# EAGLE schematic watch (EAGLE 5.11)
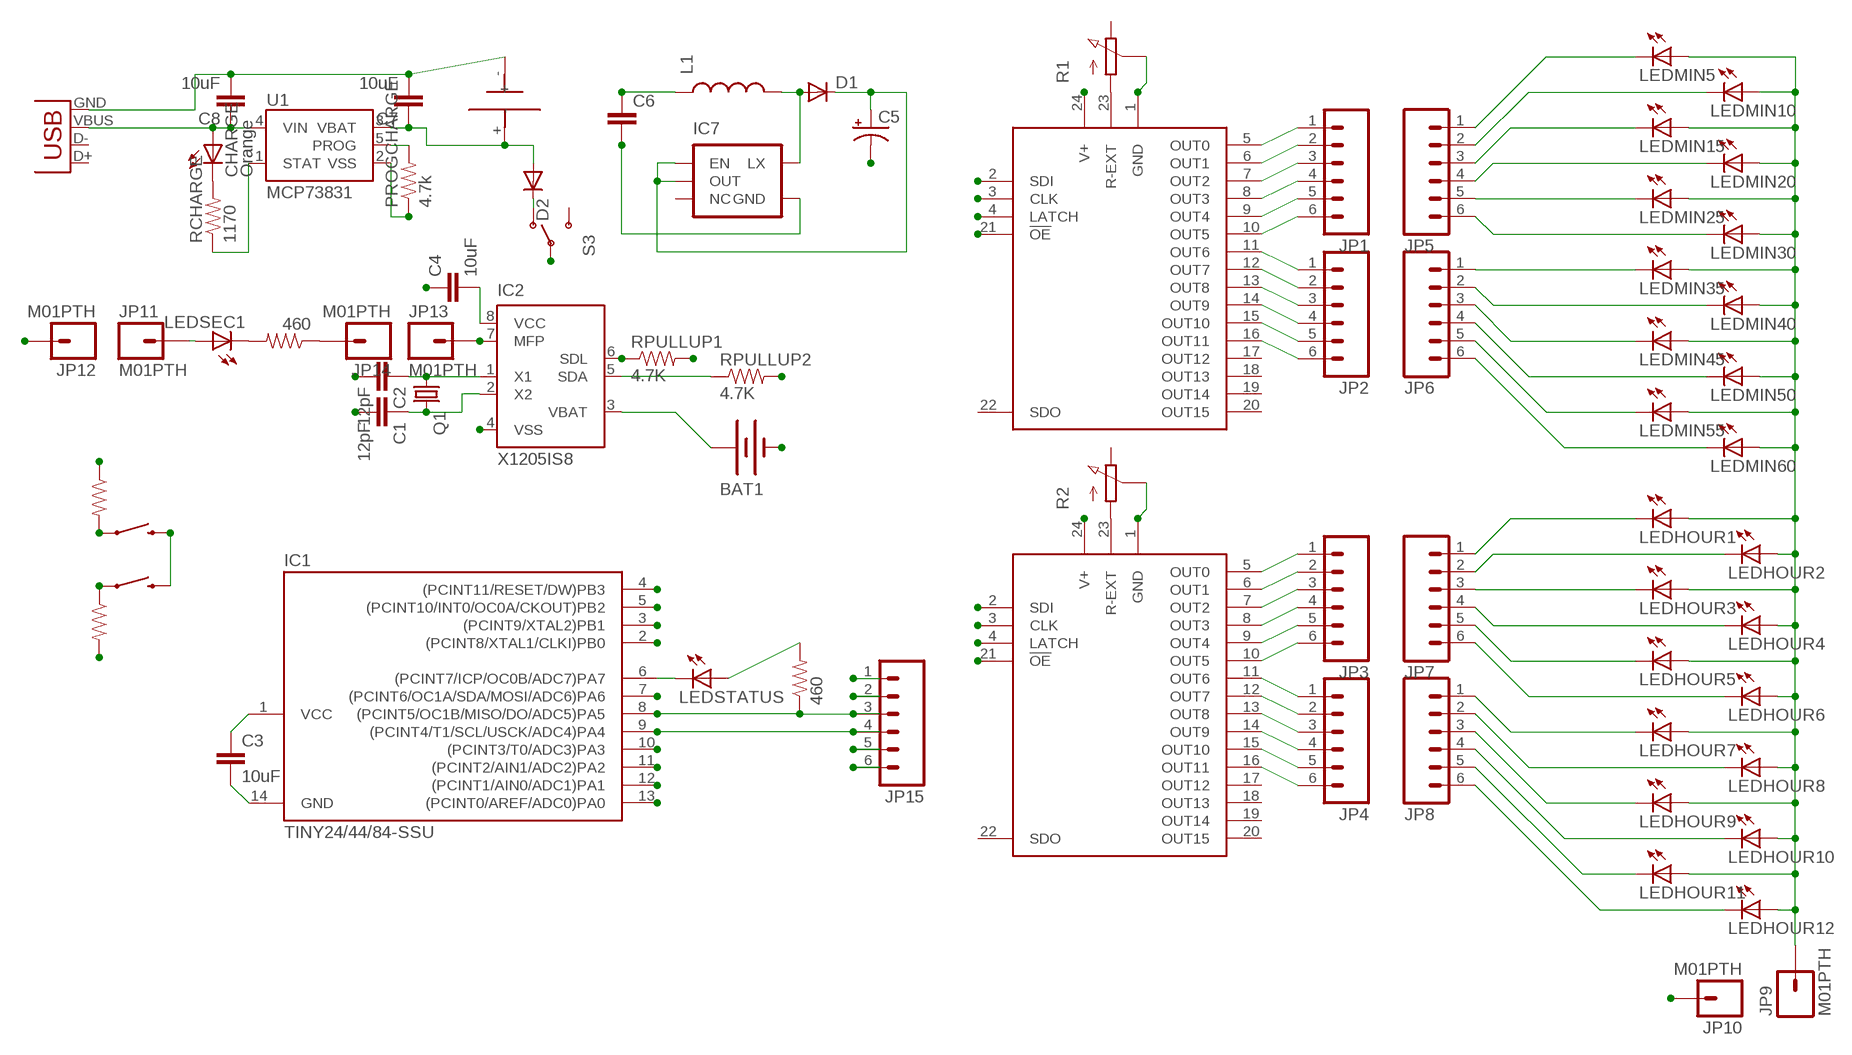
[diagram p0: schematic, sheet 1]

## Parts
BAT1  BATTERY12MM  [BATTCON_12MM]
C1  12pF  CAP0805  [0805]
C2  12pF  CAP0805  [0805]
C3  10uF  CAP0805  [0805]
C4  10uF  CAP0805  [0805]
C5  CAP_POL3528-KIT  [EIA3528-KIT]
C6  CAP0805  [0805]
C7  10uF  CAP0805  [0805]
C8  10uF  CAP0805  [0805]
CHARGE  Orange  LEDCHIPLED_0805  [CHIPLED_0805]
D1  DIODE-SOD80C  [SOD80C]
D2  DIODE-SOD80C  [SOD80C]
G1  RCR123A  [CR2/3]
IC1  TINY24/44/84-SSU  [SOIC14]
IC2  X1205IS8  [SO-08]
IC3  TLC5925I  [SO24L]
IC4  TLC5925I  [SO24L]
IC7  V_REG_NCP1400SOT23-5  [SOT23-5]
JP1  M06SIP  [1X06]
JP2  M06SIP  [1X06]
JP3  M06SIP  [1X06]
JP4  M06SIP  [1X06]
JP5  M06SIP  [1X06]
JP6  M06SIP  [1X06]
JP7  M06SIP  [1X06]
JP8  M06SIP  [1X06]
JP9  M01PTH  [1X01]
JP10  M01PTH  [1X01]
JP11  M01PTH  [1X01]
JP12  M01PTH  [1X01]
JP13  M01PTH  [1X01]
JP14  M01PTH  [1X01]
JP15  M06SMD  [1X06-SMD]
L1  INDUCTOR-B82462G  [B82462G]
LEDHOUR1  LEDCHIPLED_0805  [CHIPLED_0805]
LEDHOUR2  LEDCHIPLED_0805  [CHIPLED_0805]
LEDHOUR3  LEDCHIPLED_0805  [CHIPLED_0805]
LEDHOUR4  LEDCHIPLED_0805  [CHIPLED_0805]
LEDHOUR5  LEDCHIPLED_0805  [CHIPLED_0805]
LEDHOUR6  LEDCHIPLED_0805  [CHIPLED_0805]
LEDHOUR7  LEDCHIPLED_0805  [CHIPLED_0805]
LEDHOUR8  LEDCHIPLED_0805  [CHIPLED_0805]
LEDHOUR9  LEDCHIPLED_0805  [CHIPLED_0805]
LEDHOUR10  LEDCHIPLED_0805  [CHIPLED_0805]
LEDHOUR11  LEDCHIPLED_0805  [CHIPLED_0805]
LEDHOUR12  LEDCHIPLED_0805  [CHIPLED_0805]
LEDMIN5  LEDCHIPLED_0805  [CHIPLED_0805]
LEDMIN10  LEDCHIPLED_0805  [CHIPLED_0805]
LEDMIN15  LEDCHIPLED_0805  [CHIPLED_0805]
LEDMIN20  LEDCHIPLED_0805  [CHIPLED_0805]
LEDMIN25  LEDCHIPLED_0805  [CHIPLED_0805]
LEDMIN30  LEDCHIPLED_0805  [CHIPLED_0805]
LEDMIN35  LEDCHIPLED_0805  [CHIPLED_0805]
LEDMIN40  LEDCHIPLED_0805  [CHIPLED_0805]
LEDMIN45  LEDCHIPLED_0805  [CHIPLED_0805]
LEDMIN50  LEDCHIPLED_0805  [CHIPLED_0805]
LEDMIN55  LEDCHIPLED_0805  [CHIPLED_0805]
LEDMIN60  LEDCHIPLED_0805  [CHIPLED_0805]
LEDSEC1  LEDCHIPLED_0805  [CHIPLED_0805]
LEDSTATUS  LEDCHIPLED_0805  [CHIPLED_0805]
PROGCHARGE  4.7k  RESISTOR0805-RES  [0805]
Q1  MC-306  [MC-306]
R1  PC25PVZ2A  [PC25]
R2  PC25PVZ2A  [PC25]
RCHARGE  1170  RESISTOR0805-RES  [0805]
RPULLUP1  4.7K  RESISTOR0805-RES  [0805]
RPULLUP2  4.7K  RESISTOR0805-RES  [0805]
RPULLUP3  4.7K  RESISTOR0805-RES  [0805]
RPULLUP4  4.7K  RESISTOR0805-RES  [0805]
RSEC  460  RESISTOR0805-RES  [0805]
RSTATUS  460  RESISTOR0805-RES  [0805]
S1  SWITCH-MOMENTARY-2-SMD-1101NE  [TACTILE-SWITCH-1101NE]
S2  SWITCH-MOMENTARY-2-SMD-1101NE  [TACTILE-SWITCH-1101NE]
S3  SWITCH-SPST-SMD-A  [SWITCH-SPST-SMD-A]
U1  MCP73831  [SOT23-5]
X1  USB-MICROB  [USB-MICROB]

## Nets
1HZ: IC1.5((PCINT10/INT0/OC0A/CKOUT)PB2) IC2.7(MFP) JP13.1
BATBACKUP: BAT1.PWR@1(+) IC2.3(VBAT)
FF: IC1.3((PCINT9/XTAL2)PB1) RPULLUP4.1 S2.P$1
GND: BAT1.GND(-) C1.2 C2.2 C3.2 C4.1 C5.C(-) C6.2 C7.2 C8.2 G1.- IC1.14(GND) IC2.4(VSS) IC3.1(GND) IC4.1(GND) IC7.4(GND) JP15.1 PROGCHARGE.1 R1.2(WIPER) R2.2(WIPER) S1.P$2 S2.P$2 U1.2(VSS) X1.GND
HOURCLOCK: IC1.11((PCINT2/AIN1/ADC2)PA2) IC4.3(CLK)
MINUTECLOCK: IC1.13((PCINT0/AREF/ADC0)PA0) IC3.3(CLK)
MISO: IC1.8((PCINT5/OC1B/MISO/DO/ADC5)PA5) JP15.3 RSTATUS.1
N$1: D1.A IC7.5(LX) L1.P$2
N$2: IC3.5(OUT0) JP1.1
N$3: IC3.6(OUT1) JP1.2
N$4: C2.1 IC2.1(X1) Q1.1
N$5: IC3.7(OUT2) JP1.3
N$6: IC3.8(OUT3) JP1.4
N$7: IC3.9(OUT4) JP1.5
N$8: LEDSEC1.C RSEC.2
N$9: CHARGE.C RCHARGE.2
N$10: RCHARGE.1 U1.1(STAT)
N$11: PROGCHARGE.2 U1.5(PROG)
N$12: IC3.10(OUT5) JP1.6
N$13: IC3.11(OUT6) JP2.1
N$14: IC3.12(OUT7) JP2.2
N$15: IC3.13(OUT8) JP2.3
N$16: JP6.4 LEDMIN50.C
N$17: IC3.14(OUT9) JP2.4
N$18: IC3.15(OUT10) JP2.5
N$19: IC3.16(OUT11) JP2.6
N$20: IC4.5(OUT0) JP3.1
N$21: IC4.6(OUT1) JP3.2
N$22: IC4.7(OUT2) JP3.3
N$23: IC4.8(OUT3) JP3.4
N$24: IC4.9(OUT4) JP3.5
N$25: IC4.10(OUT5) JP3.6
N$26: IC4.11(OUT6) JP4.1
N$27: IC4.12(OUT7) JP4.2
N$28: IC4.13(OUT8) JP4.3
N$29: IC4.14(OUT9) JP4.4
N$30: IC4.15(OUT10) JP4.5
N$31: IC4.16(OUT11) JP4.6
N$32: JP5.1 LEDMIN5.C
N$33: JP5.2 LEDMIN10.C
N$34: JP5.3 LEDMIN15.C
N$35: JP5.4 LEDMIN20.C
N$36: JP5.5 LEDMIN25.C
N$37: JP5.6 LEDMIN30.C
N$38: JP6.1 LEDMIN35.C
N$39: JP6.2 LEDMIN40.C
N$40: JP6.3 LEDMIN45.C
N$41: JP6.5 LEDMIN55.C
N$42: JP6.6 LEDMIN60.C
N$43: JP7.1 LEDHOUR1.C
N$44: JP7.2 LEDHOUR2.C
N$45: JP7.3 LEDHOUR3.C
N$46: JP7.4 LEDHOUR4.C
N$47: JP7.5 LEDHOUR5.C
N$48: JP7.6 LEDHOUR6.C
N$49: JP8.1 LEDHOUR7.C
N$50: JP8.2 LEDHOUR8.C
N$51: JP8.3 LEDHOUR9.C
N$52: JP8.4 LEDHOUR10.C
N$53: JP8.5 LEDHOUR11.C
N$54: JP8.6 LEDHOUR12.C
N$55: JP11.1 LEDSEC1.A
N$56: IC3.23(R-EXT) R1.1(VCC)
N$57: C1.1 IC2.2(X2) Q1.4
N$58: IC1.6((PCINT7/ICP/OC0B/ADC7)PA7) LEDSTATUS.C
N$59: LEDSTATUS.A RSTATUS.2
N$60: D2.C S3.1(O)
N$61: JP14.1 RSEC.1
N$62: IC4.23(R-EXT) R2.1(VCC)
OE: IC1.12((PCINT1/AIN0/ADC1)PA1) IC3.21(!OE) IC4.21(!OE)
RESET: IC1.4((PCINT11/RESET/DW)PB3) JP15.5
RW: IC1.2((PCINT8/XTAL1/CLKI)PB0) RPULLUP3.2 S1.P$1
SCL: IC1.9((PCINT4/T1/SCL/USCK/ADC4)PA4) IC2.6(SDL) JP15.4 RPULLUP1.1
SDA: IC1.7((PCINT6/OC1A/SDA/MOSI/ADC6)PA6) IC2.5(SDA) JP15.6 RPULLUP2.1
SERIALOUT: IC1.10((PCINT3/T0/ADC3)PA3) IC3.2(SDI) IC4.2(SDI)
VCC: C5.A(+) D1.C IC7.1(EN) IC7.2(OUT) JP10.1
VCCTOP: JP9.1 LEDHOUR1.A LEDHOUR2.A LEDHOUR3.A LEDHOUR4.A LEDHOUR5.A LEDHOUR6.A LEDHOUR7.A LEDHOUR8.A LEDHOUR9.A LEDHOUR10.A LEDHOUR11.A LEDHOUR12.A LEDMIN5.A LEDMIN10.A LEDMIN15.A LEDMIN20.A LEDMIN25.A LEDMIN30.A LEDMIN35.A LEDMIN40.A LEDMIN45.A LEDMIN50.A LEDMIN55.A LEDMIN60.A
VRAW: C7.1 D2.A G1.+ U1.3(VBAT)
VRAWSWITCHED: C3.1 C4.2 C6.1 IC1.1(VCC) IC2.8(VCC) IC3.4(LATCH) IC3.24(V+) IC4.4(LATCH) IC4.24(V+) JP12.1 JP15.2 L1.P$1 RPULLUP1.2 RPULLUP2.2 RPULLUP3.1 RPULLUP4.2 S3.2(P)
VUSB: C8.1 CHARGE.A U1.4(VIN) X1.VBUS
Unconnected: IC3.17(OUT12) IC3.18(OUT13) IC3.19(OUT14) IC3.20(OUT15) IC3.22(SDO) IC4.17(OUT12) IC4.18(OUT13) IC4.19(OUT14) IC4.20(OUT15) IC4.22(SDO) IC7.3(NC) R1.3(GND) R2.3(GND) S3.3(S) X1.D+ X1.D-

## Library data of the parts
BAT1 = SparkFun:BATTERY: Battery Holders Various common sizes : AA, AAA, 20mm coin cell and 12mm coin cell.
C1-C4 C6-C8 = SparkFun:CAP: Capacitor Standard 0603 ceramic capacitor, and 0.1" leaded capacitor.
C5 = SparkFun:CAP_POL: Capacitor Polarized These are standard SMD and PTH capacitors. Normally 10uF, 47uF, and 100uF in electrolytic and tantalum varieties. Always verify the external diameter of the through hole cap, it varies with capacity, voltage, and manufacturer. The EIA devices should be standard.
CHARGE LEDHOUR1-LEDHOUR12 LEDMIN5 LEDMIN10 LEDMIN15 LEDMIN20 LEDMIN25 LEDMIN30 LEDMIN35 LEDMIN40 LEDMIN45 LEDMIN50 LEDMIN55 LEDMIN60 LEDSEC1 LEDSTATUS = led:LED: LED OSRAM: - CHIPLED LG R971, LG N971, LY N971, LG Q971, LY Q971, LO R971, LY R971 LH N974, LH R974 LS Q976, LO Q976, LY Q976 LO Q996 - Hyper CHIPLED LW Q18S LB Q993, LB Q99A, LB R99A - SideLED LS A670, LO A670, LY A670, LG A670, LP A670 LB A673, LV A673, LT A673, LW A673 LH A674 LY A675 LS A676, LA A676, LO A676, LY A676, LW A676 LS A679, LY A679, LG A679 - Hyper Micro SIDELED® LS Y876, LA Y876, LO Y876, LY Y876 LT Y87S - SmartLED LW L88C, LW L88S LB L89C, LB L89S, LG L890 LS L89K, LO L89K, LY L89K LS L896, LA L896, LO L896, LY L896 - TOPLED LS T670, LO T670, LY T670, LG T670, LP T670 LSG T670, LSP T670, LSY T670, LOP T670, LYG T670 LG T671, LOG T671, LSG T671 LB T673, LV T673, LT T673, LW T673 LH T674 LS T676, LA T676, LO T676, LY T676, LB T676, LH T676, LSB T676, LW T676 LB T67C, LV T67C, LT T67C, LS T67K, LO T67K, LY T67K, LW E67C LS E67B, LA E67B, LO E67B, LY E67B, LB E67C, LV E67C, LT E67C LW T67C LS T679, LY T679, LG T679 LS T770, LO T770, LY T770, LG T770, LP T770 LB T773, LV T773, LT T773, LW T773 LH T774 LS E675, LA E675, LY E675, LS T675 LS T776, LA T776, LO T776, LY T776, LB T776 LHGB T686 LT T68C, LB T68C - Hyper Mini TOPLED® LB M676 - Mini TOPLED Santana® LG M470 LS M47K, LO M47K, LY M47K Source: http://www.osram.convergy.de LUXEON: - LUMILED® LXK2-PW12-R00, LXK2-PW12-S00, LXK2-PW14-U00, LXK2-PW14-V00 LXK2-PM12-R00, LXK2-PM12-S00, LXK2-PM14-U00 LXK2-PE12-Q00, LXK2-PE12-R00, LXK2-PE12-S00, LXK2-PE14-T00, LXK2-PE14-U00 LXK2-PB12-K00, LXK2-PB12-L00, LXK2-PB12-M00, LXK2-PB14-N00, LXK2-PB14-P00, LXK2-PB14-Q00 LXK2-PR12-L00, LXK2-PR12-M00, LXK2-PR14-Q00, LXK2-PR14-R00 LXK2-PD12-Q00, LXK2-PD12-R00, LXK2-PD12-S00 LXK2-PH12-R00, LXK2-PH12-S00 LXK2-PL12-P00, LXK2-PL12-Q00, LXK2-PL12-R00 Source: www.luxeon.com KINGBRIGHT: KA-3528ASYC Source: www.kingbright.com
D1 D2 = diode:DIODE-: DIODE
G1 = RyanK:RCR123A
IC1 = avr-7:TINY24/44/84
IC2 = RyanK:X1205*: 2-Wire RTC Real Time Clock/Calendar; OC_FARNELL: unknown; OC_NEWARK: unknown
IC3 IC4 = RyanK:TLC5925I: TCL5925i
IC7 = SparkFun:V_REG_NCP1400: Switching step-up voltage regulator NCP1400 switiching regulator takes single cell AA and outputs 100mA at 3.3V or 5V with minimal number of external components.
JP1-JP8 = SparkFun:M06: Header 6 Standard 6-pin 0.1" header. Use with straight break away headers (SKU : PRT-00116), right angle break away headers (PRT-00553), swiss pins (PRT-00743), machine pins (PRT-00117), and female headers (PRT-00115). Molex polarized connector foot print use with SKU : PRT-08094 with associated crimp pins and housings. NOTES ON THE VARIANTS LOCK and LOCK_LONGPADS... This footprint was designed to help hold the alignment of a through-hole component (i.e. 6-pin header) while soldering it into place. You may notice that each hole has been shifted either up or down by 0.005 of an inch from it's more standard position (which is a perfectly straight line). This slight alteration caused the pins (the squares in the middle) to touch the edges of the holes. Because they are alternating, it causes a "brace" to hold the component in place. 0.005 has proven to be the perfect amount of "off-center" position when using our standard breakaway headers. Although looks a little odd when you look at the bare footprint, once you have a header in there, the alteration is very hard to notice. Also, if you push a header all the way into place, it is covered up entirely on the bottom side. This idea of altering the position of holes to aid alignment will be further integrated into the Sparkfun Library for other footprints. It can help hold any component with 3 or more connection pins.
JP9-JP14 = SparkFun:M01: Header 1 Standard 1-pin 0.1" header. Use with straight break away headers (SKU : PRT-00116), right angle break away headers (PRT-00553), swiss pins (PRT-00743), machine pins (PRT-00117), and female headers (PRT-00115).
JP15 = RyanK:M06: Header 6 Standard 6-pin 0.1" header. Use with straight break away headers (SKU : PRT-00116), right angle break away headers (PRT-00553), swiss pins (PRT-00743), machine pins (PRT-00117), and female headers (PRT-00115). Molex polarized connector foot print use with SKU : PRT-08094 with associated crimp pins and housings. NOTES ON THE VARIANTS LOCK and LOCK_LONGPADS... This footprint was designed to help hold the alignment of a through-hole component (i.e. 6-pin header) while soldering it into place. You may notice that each hole has been shifted either up or down by 0.005 of an inch from it's more standard position (which is a perfectly straight line). This slight alteration caused the pins (the squares in the middle) to touch the edges of the holes. Because they are alternating, it causes a "brace" to hold the component in place. 0.005 has proven to be the perfect amount of "off-center" position when using our standard breakaway headers. Although looks a little odd when you look at the bare footprint, once you have a header in there, the alteration is very hard to notice. Also, if you push a header all the way into place, it is covered up entirely on the bottom side. This idea of altering the position of holes to aid alignment will be further integrated into the Sparkfun Library for other footprints. It can help hold any component with 3 or more connection pins.
L1 = SparkFun:INDUCTOR: Inductors Basic Inductor/Choke - 0603 and 1206. Footprints are not proven and vary greatly between part numbers.
PROGCHARGE RCHARGE RPULLUP1-RPULLUP4 RSEC RSTATUS = SparkFun:RESISTOR: Resistor Basic schematic elements and footprints for 0603, 1206, and PTH resistors.
Q1 = crystal:MC-306: kHz RANGE CRYSTAL UNIT SMD Source: MC-306_405_406_E07X.PDF Homepage <www.epsontoyocom.co.jp>; MPN: MC-306 60.0KHZ 100PPM ,12.5PF; OC_FARNELL: 1278040; OC_NEWARK: 31M5576
R1 R2 = RyanK:PC25: VITROHM POTENTIOMETER
S1 S2 = SparkFun:SWITCH-MOMENTARY-2
S3 = SparkFun:SWITCH-SPST: SPST Switch Simple slide switch. Spark Fun Electronics SKU : COM-00102
U1 = SparkFun:MCP73831: Microchip's MCP73831 Miniature single cell, fully integrated Li-Ion, Li-polymer charge management controller http://ww1.microchip.com/downloads/en/DeviceDoc/21984a.pdf
X1 = SparkFun:USB: USB Connectors USB-B-PTH is fully proven SKU : PRT-00139 USB-miniB is fully proven SKU : PRT-00587 USB-A-PCB is untested. USB-A-H is throughly reviewed, but untested. Spark Fun Electronics SKU : PRT-00437 USB-B-SMT is throughly reviewed, but untested. Needs silkscreen touching up. USB-A-S has not been used/tested USB-MB-H has not been used/tested